# Altium schematic sheet Index.SchDoc
size 420 x 297 mm; SheetNumber: 2; SheetTotal: 34
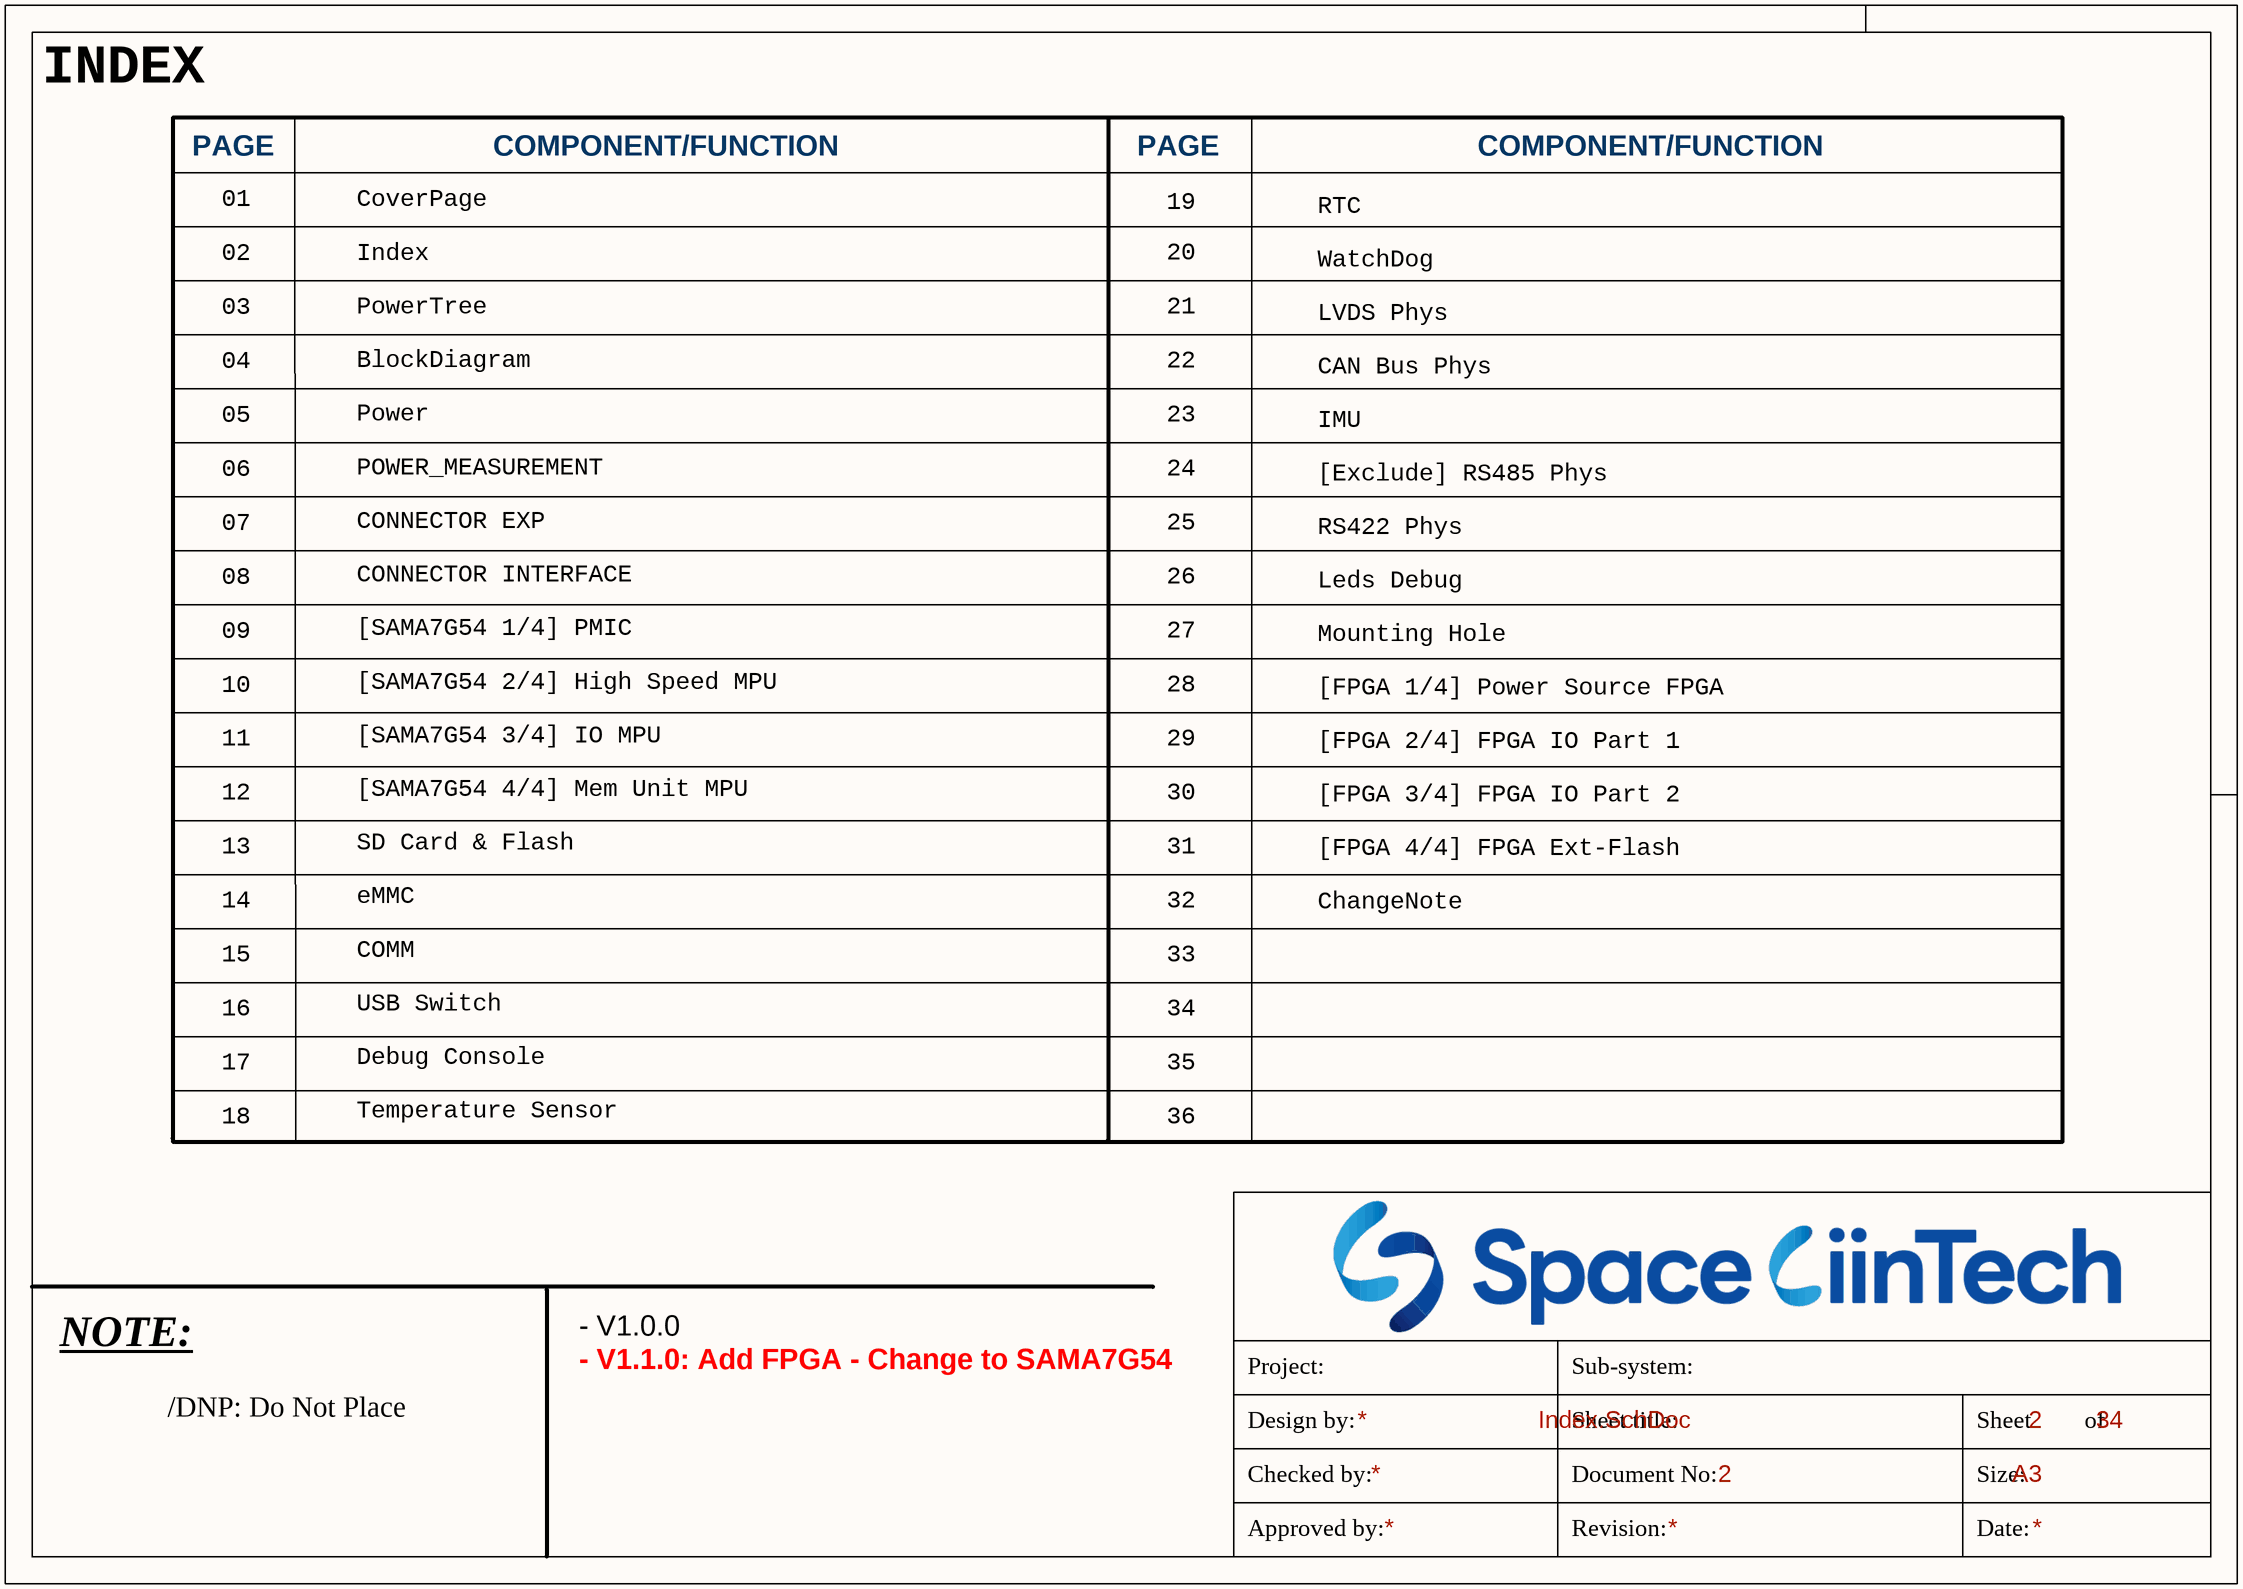
[diagram p0: Index.SchDoc]

## Notes on the sheet
- INDEX
- PAGE
- COMPONENT/FUNCTION
- 01
- 02
- CoverPage
- Index
- 19
- 20
- RTC
- 03
- PowerTree
- 21
- WatchDog
- LVDS Phys
- 04
- BlockDiagram
- 22
- CAN Bus Phys
- 05
- Power
- 23
- IMU
- 06
- 07
- CONNECTOR EXP
- POWER_MEASUREMENT
- 24
- 25
- [Exclude] RS485 Phys
- 08
- CONNECTOR INTERFACE
- 26
- RS422 Phys
- Leds Debug
- 09
- [SAMA7G54 1/4] PMIC
- 27
- Mounting Hole
- 10
- [SAMA7G54 2/4] High Speed MPU
- 28
- [FPGA 1/4] Power Source FPGA
- 11
- 12
- [SAMA7G54 3/4] IO MPU
- [SAMA7G54 4/4] Mem Unit MPU
- 29
- 30
- [FPGA 2/4] FPGA IO Part 1
- 13
- SD Card & Flash
- 31
- [FPGA 3/4] FPGA IO Part 2
- [FPGA 4/4] FPGA Ext-Flash
- 14
- eMMC
- 32
- ChangeNote
- 15
- COMM
- 33
- 16
- 17
- USB Switch
- Debug Console
- 34
- 35
- 18
- Temperature Sensor
- 36
- - V1.0.0
- NOTE:
- - V1.1.0: Add FPGA - Change to SAMA7G54
- /DNP: Do Not Place
- Project:
- Sub-system:
- Design by:
- Sheet title:
- Sheet
- of
- Checked by:
- Approved by:
- Revision:
- Document No:
- Size:
- Date:
- A3